# EAGLE design msp_talking_tom_v5 (EAGLE 7.3.0)
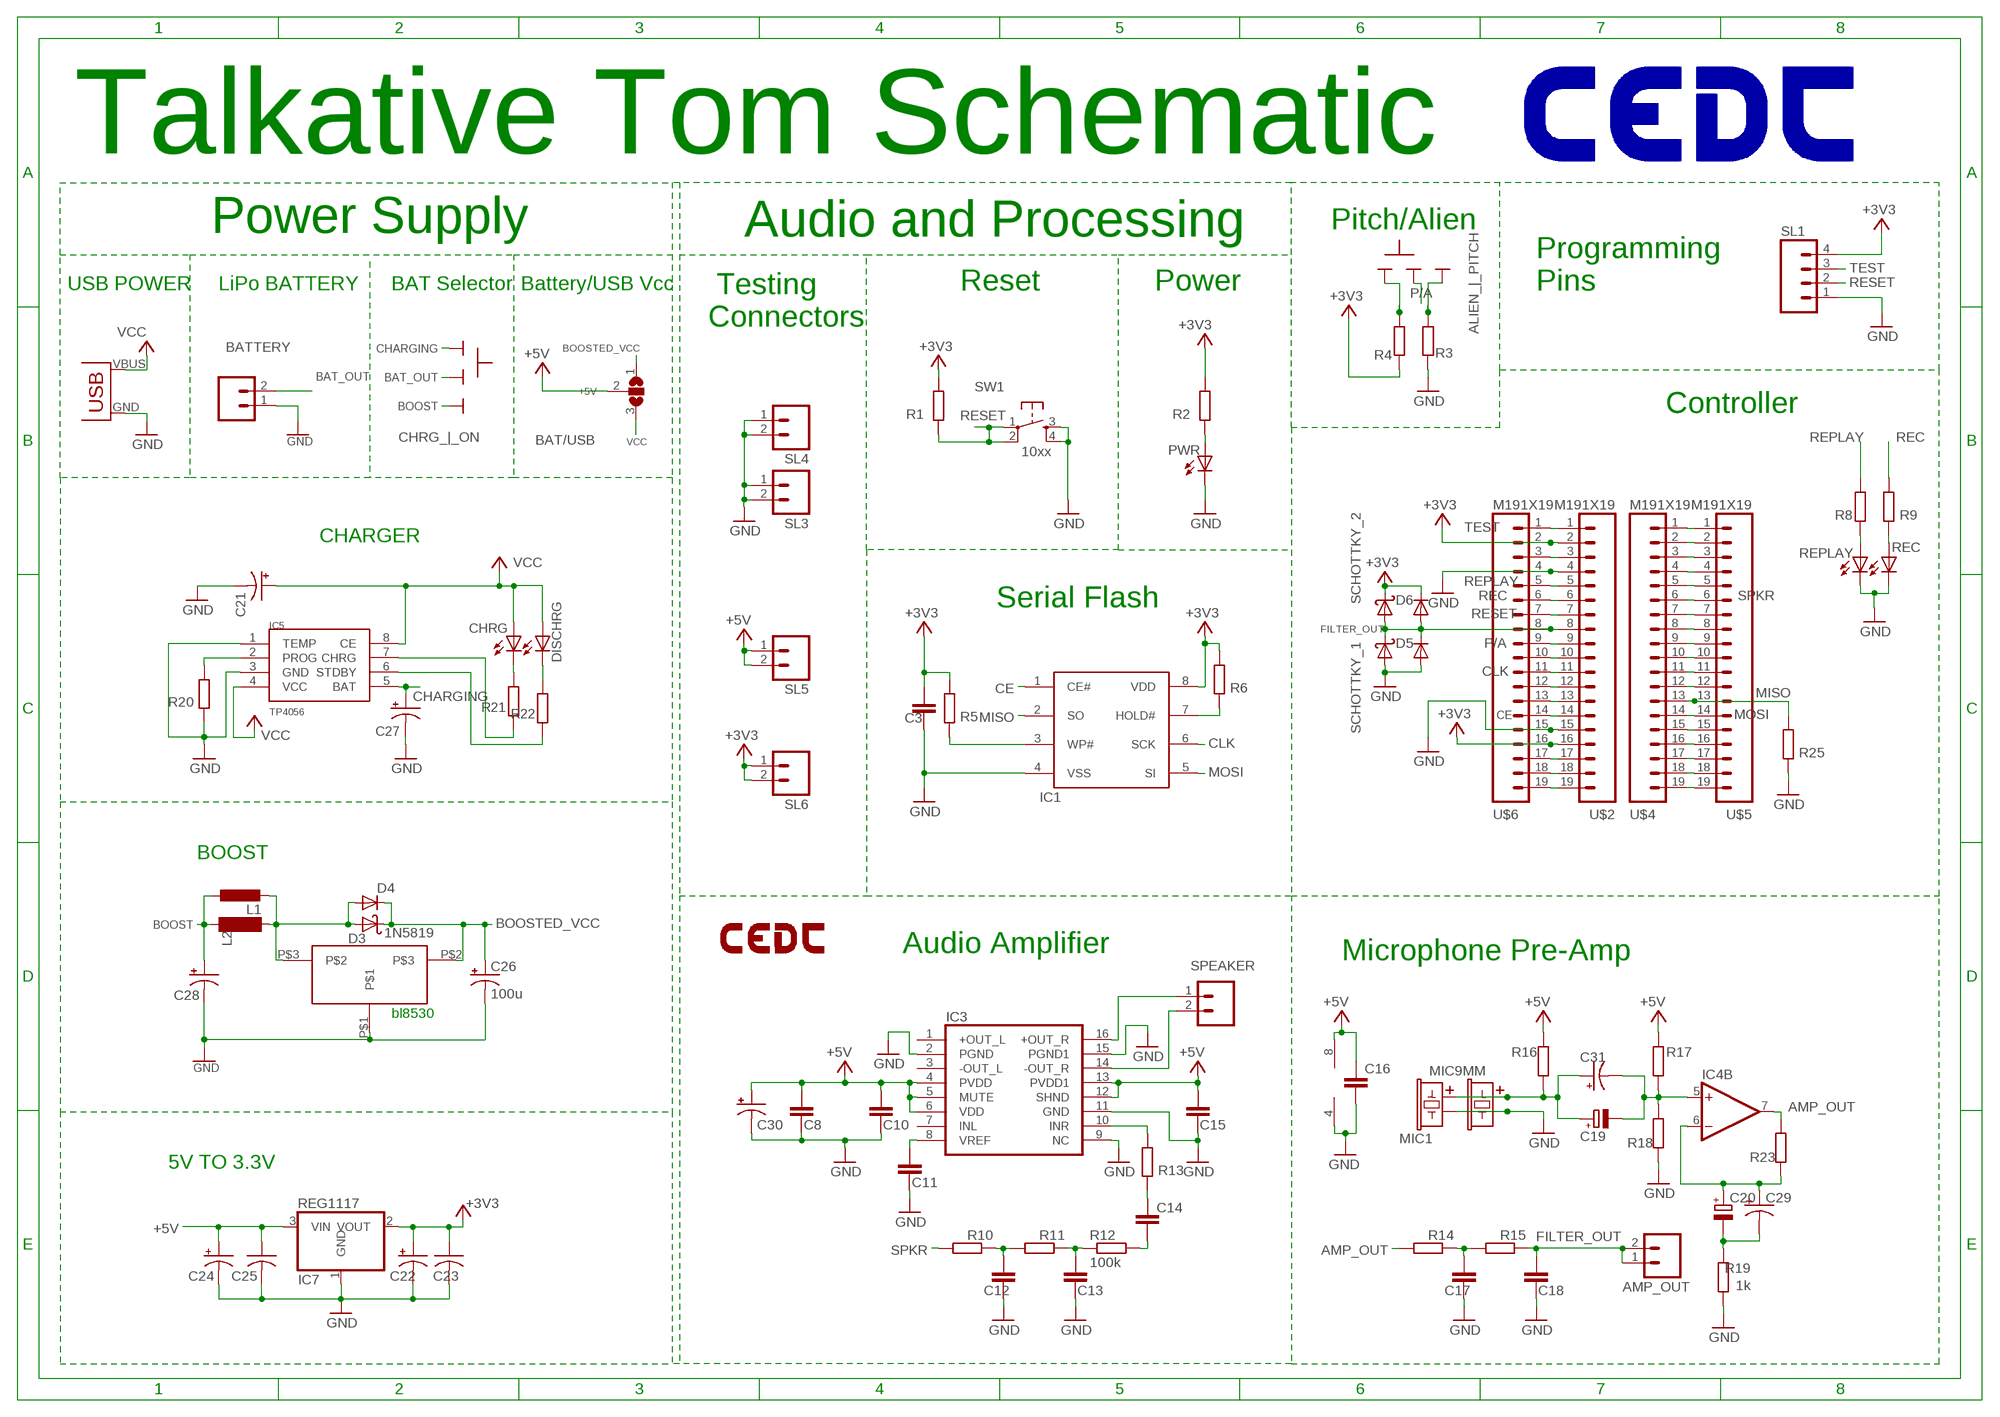
[diagram p0: schematic, sheet 1]

## Parts
ALIEN_|_PITCH  SLIDESWITCH-BIG  [BIGSWITCH]
AMP_OUT  M02  [02P]
BAT/USB  SJ2W  [SJ_2]
BATTERY  M02JST-PTH-2  M02  [02P]
C3  0.1u  C-EUC0805  [C0805]
C8  1uf  C-EUC1206  [C1206]
C10  1uf  C-EUC1206  [C1206]
C11  0.1uf  C-EUC1206  [C1206]
C12  0.1u  C-EUC0805  [C0805]
C13  0.1uf  C-EUC0805  [C0805]
C14  0.47uF  C-EUC0603  [C0603]
C15  1uf  C-EUC1206  [C1206]
C16  0.1u  C-EUC0805  [C0805]
C17  0.1u  C-EUC0805  [C0805]
C18  0.1u  C-EUC0805  [C0805]
C19  10u  CPOL-EUE2.5-5  [E2,5-5]
C20  10u  CPOL-EUE2.5-5  [E2,5-5]
C21  10u  CAP_POL_10V  [C/6032-28R]
C22  10u  CAP_POL_10V  [C/6032-28R]
C23  0.1u  CAP0805  [C0805]
C24  10u  CAP_POL_10V  [C/6032-28R]
C25  0.1u  CAP0805  [C0805]
C26  100u  CAP_POL_10V  [C/6032-28R]
C27  10u  CAP_POL_10V  [C/6032-28R]
C28  10u  CAP_POL_10V  [C/6032-28R]
C29  10u  CAP_POL_10V  [C/6032-28R]
C30  CAP_POL_10V  [C/6032-28R]
C31  10u  CAP_POL_10V  [C/6032-28R]
CHRG  LED3MM  [LED3MM]
CHRG_|_ON  SLIDESWITCH-BIG  [BIGSWITCH]
D3  1N5819  [DO41-10]
D4  DIODE_DIODE-DO214AC  [DIODE_DO214AC]
D5  DIODE_DIODE-DO214AC  [DIODE_DO214AC]
D6  DIODE_DIODE-DO214AC  [DIODE_DO214AC]
DISCHRG  LED3MM  [LED3MM]
IC1  SST25VF040B_SPI_FLASH  [SOIC08]
IC3  PAM8403  [SOP-16]
IC4  LM358N  [DIL08]
IC5  TP4056  [SOP-8]
IC6  BL8530_5V  [BL8530_5V]
IC7  REG1117  [SOT223]
L1  L-EUL5650M  [L5650M]
L2  47uH  MS85  [MS85]
LOGO2  LOGO-CEDTSILK-18MM  [LOGO-CEDT-SILK-18MM]
MIC1  MICMIC-4.5MM  [MIC-4.5MM]
MIC9MM  MIC9.7MM  [MIC-9.7MM]
PWR  LED3MM  [LED3MM]
R1  10k  R-EU_0204/7  [0204/7]
R2  1k  R-EU_0204/7  [0204/7]
R3  10k  R-EU_0204/7  [0204/7]
R4  10k  R-EU_0204/7  [0204/7]
R5  10k  R-EU_0204/7  [0204/7]
R6  10k  R-EU_0204/7  [0204/7]
R8  1k  R-EU_0204/7  [0204/7]
R9  1k  R-EU_0204/7  [0204/7]
R10  330  R-EU_0204/7  [0204/7]
R11  330  R-EU_0204/7  [0204/7]
R12  100k  R-EU_0204/7  [0204/7]
R13  10k  R-EU_0204/7  [0204/7]
R14  330  R-EU_0204/7  [0204/7]
R15  330  R-EU_0204/7  [0204/7]
R16  4.7k  R-EU_0204/7  [0204/7]
R17  20k  R-EU_0204/7  [0204/7]
R18  10k  R-EU_0204/7  [0204/7]
R19  1k  R-EU_0204/7  [0204/7]
R20  R-EU_0204/7  [0204/7]
R21  470  R-EU_0204/7  [0204/7]
R22  470  R-EU_0204/7  [0204/7]
R23  20k  R-EU_0204/7  [0204/7]
R25  10k  R-EU_0204/7  [0204/7]
REC  LED3MM  [LED3MM]
REPLAY  LED3MM  [LED3MM]
SCHOTTKY_1  1N5819  [DO41-10]
SCHOTTKY_2  1N5819  [DO41-10]
SL1  M04  [04P]
SL3  M02  [02P]
SL4  M02  [02P]
SL5  M02  [02P]
SL6  M02  [02P]
SPEAKER  M02JST-PTH-VERT  M02  [02P]
SW1  10xx  OMRON_SWITCH_10-XX  [B3F-10XX]
U$1  USB(POWER)  [USB(POWER)]
U$2  M191X19  [1X19]
U$4  M191X19  [1X19]
U$5  M191X19  [1X19]
U$6  M191X19  [1X19]

## Nets
+3V3: C3.1 C22.+ C23.1 D6.C IC1.8(VDD) IC7.2(VOUT) R1.2 R2.2 R4.2 R5.1 R6.2 SCHOTTKY_2.C SL1.4 SL6.1 SL6.2 U$2.2 U$2.16 U$6.2 U$6.16
+5V: BAT/USB.2 C8.1 C10.2 C15.2 C16.1 C24.+ C25.1 C30.+ IC3.4(PVDD) IC3.5(MUTE) IC3.6(VDD) IC3.12(SHND) IC3.13(PVDD1) IC4.8(P:V+) IC7.3(VIN) R16.2 R17.2 SL5.1 SL5.2
AMP_OUT: IC4.7(B:OUT) R14.1 R23.2
AVCC: U$4.16 U$5.16
BAT_OUT: BATTERY.2 CHRG_|_ON.2
BOOST: C28.+ CHRG_|_ON.3 L1.1 L2.1
BOOSTED_VCC: BAT/USB.1 C26.+ D3.C D4.C IC6.P$2
CE: IC1.1(CE#) U$2.14 U$6.14
CHARGING: C27.+ CHRG_|_ON.1 IC5.5(BAT)
CLK: IC1.6(SCK) U$2.11 U$6.11
DVCC: U$4.2 U$5.2
FILTER_OUT: AMP_OUT.1 AMP_OUT.2 C18.1 D5.C D6.A R15.2 SCHOTTKY_1.C SCHOTTKY_2.A U$2.8 U$6.8
GND: BATTERY.1 C3.2 C8.2 C10.1 C11.2 C12.2 C13.2 C15.1 C16.2 C17.2 C18.2 C21.- C22.- C23.2 C24.- C25.2 C26.- C27.- C28.- C30.- D5.A IC1.4(VSS) IC3.2(PGND) IC3.9(NC) IC3.11(GND) IC3.15(PGND1) IC4.4(P:V-) IC5.1(TEMP) IC5.3(GND) IC6.P$1 IC7.1(GND) MIC1.+ MIC9MM.2 PWR.K(C) R3.2 R18.1 R19.1 R20.1 R25.1 REC.K(C) REPLAY.K(C) SCHOTTKY_1.A SL1.1 SL3.1 SL3.2 SL4.1 SL4.2 SW1.3(S) SW1.4(S1) U$1.GND U$2.4 U$2.15 U$6.4 U$6.15
MICIN1: C13.1 R11.2 R12.1
MISO: IC1.2(SO) R25.2 U$4.13 U$5.13
MOSI: IC1.5(SI) U$4.14 U$5.14
N$1: U$2.3 U$6.3
N$2: IC1.7(HOLD#) R6.1
N$3: IC1.3(WP#) R5.2
N$4: U$4.1 U$5.1
N$5: U$4.15 U$5.15
N$6: ALIEN_|_PITCH.3 R3.1
N$7: U$4.4 U$5.4
N$8: IC3.16(+OUT_R) SPEAKER.1
N$9: IC3.14(-OUT_R) SPEAKER.2
N$10: C14.2 R13.2
N$11: IC3.10(INR) R13.1
N$12: C12.1 R10.2 R11.1
N$13: PWR.A R2.1
N$14: C17.1 R14.2 R15.1
N$18: IC5.2(PROG) R20.2
N$19: IC5.7(CHRG) R21.1
N$20: C14.1 R12.2
N$21: R8.1 REPLAY.A
N$22: C11.1 IC3.8(VREF)
N$24: ALIEN_|_PITCH.1 R4.1
N$25: IC5.6(STDBY) R22.1
N$27: CHRG.K(C) R21.2
N$28: DISCHRG.K(C) R22.2
N$29: D3.A D4.A IC6.P$3 L1.2 L2.2
N$30: C19.+ C31.+ MIC1.- MIC9MM.1 R16.1
N$32: C19.- C31.- IC4.5(B:+IN) R17.1 R18.2
N$33: C20.+ C29.+ IC4.6(B:-IN) R23.1
N$34: R9.2 REC.A
N$35: U$2.19 U$6.19
N$36: C20.- C29.- R19.2
N$37: U$2.18 U$6.18
N$38: U$2.17 U$6.17
N$39: U$2.13 U$6.13
N$40: U$2.12 U$6.12
N$41: U$2.10 U$6.10
N$47: U$4.3 U$5.3
N$48: U$4.5 U$5.5
N$49: U$4.7 U$5.7
N$50: U$4.8 U$5.8
N$51: U$4.9 U$5.9
N$52: U$4.10 U$5.10
N$55: U$4.11 U$5.11
N$56: U$4.12 U$5.12
N$57: U$4.17 U$5.17
N$58: U$4.18 U$5.18
N$59: U$4.19 U$5.19
P/A: ALIEN_|_PITCH.2 U$2.9 U$6.9
REC: R9.1 U$2.6 U$6.6
REPLAY: R8.2 U$2.5 U$6.5
RESET: R1.1 SL1.2 SW1.1(P) SW1.2(P1) U$2.7 U$6.7
SPKR: R10.1 U$4.6 U$5.6
TEST: SL1.3 U$2.1 U$6.1
VCC: BAT/USB.3 C21.+ CHRG.A DISCHRG.A IC5.4(VCC) IC5.8(CE) U$1.VBUS(VCC)
Unconnected: IC3.1(+OUT_L) IC3.3(-OUT_L) IC3.7(INL) IC4.1(A:OUT) IC4.2(A:-IN) IC4.3(A:+IN)

## Notes on the sheet
- Talkative Tom Schematic
- Power Supply | Audio and Processing | Pitch/Alien
- USB POWER | LiPo BATTERY | BAT Selector | Battery/USB Vcc | Reset | Power
- Programming
  Pins
- Testing 
  Connectors
- Controller
- CHARGER
- Serial Flash
- BOOST
- Audio Amplifier | Microphone Pre-Amp
- bl8530
- 5V TO 3.3V

## Library data of the parts
ALIEN_|_PITCH CHRG_|_ON = CEDT_JANUARY_2015_v5:SLIDESWITCH
AMP_OUT BATTERY SPEAKER = CEDT_JANUARY_2015_v5:M02: AMP QUICK CONNECTOR
BAT/USB = jumper:SJ2W: SMD solder JUMPER
C3 C8 C10 C11 C14 C15 = rcl:C-EU: CAPACITOR, European symbol
C12 C13 C17 C18 = Arduino_Hackathon_v5:C-EU: CAPACITOR, European symbol
C16 = resistor:C-EU: CAPACITOR, European symbol
C19 C20 = rcl:CPOL-EU: POLARIZED CAPACITOR, European symbol
C21 C26 C29 C31 = CEDT_JANUARY_2015_v7:CAP_POL
C22 C24 C27 C28 = CEDT_JANUARY_2015_v5:CAP_POL
C23 C25 = CEDT_JANUARY_2015_v5:CAP
C30 = CEDT_SEPTEMBER_V2:CAP_POL
CHRG DISCHRG = adafruit:LED: LED OSRAM: - CHIPLED LG R971, LG N971, LY N971, LG Q971, LY Q971, LO R971, LY R971 LH N974, LH R974 LS Q976, LO Q976, LY Q976 LO Q996 - Hyper CHIPLED LW Q18S LB Q993, LB Q99A, LB R99A - SideLED LS A670, LO A670, LY A670, LG A670, LP A670 LB A673, LV A673, LT A673, LW A673 LH A674 LY A675 LS A676, LA A676, LO A676, LY A676, LW A676 LS A679, LY A679, LG A679 - Hyper Micro SIDELED® LS Y876, LA Y876, LO Y876, LY Y876 LT Y87S - SmartLED LW L88C, LW L88S LB L89C, LB L89S, LG L890 LS L89K, LO L89K, LY L89K LS L896, LA L896, LO L896, LY L896 - TOPLED LS T670, LO T670, LY T670, LG T670, LP T670 LSG T670, LSP T670, LSY T670, LOP T670, LYG T670 LG T671, LOG T671, LSG T671 LB T673, LV T673, LT T673, LW T673 LH T674 LS T676, LA T676, LO T676, LY T676, LB T676, LH T676, LSB T676, LW T676 LB T67C, LV T67C, LT T67C, LS T67K, LO T67K, LY T67K, LW E67C LS E67B, LA E67B, LO E67B, LY E67B, LB E67C, LV E67C, LT E67C LW T67C LS T679, LY T679, LG T679 LS T770, LO T770, LY T770, LG T770, LP T770 LB T773, LV T773, LT T773, LW T773 LH T774 LS E675, LA E675, LY E675, LS T675 LS T776, LA T776, LO T776, LY T776, LB T776 LHGB T686 LT T68C, LB T68C - Hyper Mini TOPLED® LB M676 - Mini TOPLED Santana® LG M470 LS M47K, LO M47K, LY M47K Source: http://www.osram.convergy.de/
D3 = arduinodaya_v9:1N5819: DIODE general purpose rectifier, 1 A
D4-D6 = TalkingTom_FINAL3_print:DIODE_DIODE-: DIODE
IC1 = CEDT_JANUARY_2015_v5:SST25VF040B_SPI_FLASH
IC3 = PAM8403:PAM8403: Dual channel audio amplifier IC - PAM8403
IC4 = CEDT_JANUARY_2015_v6 (2):LM358: OP AMP also LM158; LM258; LM2904 Source: http://cache.national.com/ds/LM/LM158.pdf
IC5 = TP4056:TP4056
IC6 = PSU_TT_SMD:BL8530_5V
IC7 = CEDT_JANUARY_2015_v5:REG1117: 800mA and 1A Low Dropout (LDO) Positive Regulator 1.8V, 2.5V, 2.85V, 3.3V, 5V, and Adj
L1 = TalkingTom_FINAL:L-EU: INDUCTOR, European symbol
L2 = inductor-neosid:MS85: INDUCTOR SMD power inductor; OC_FARNELL: unknown; OC_NEWARK: unknown
LOGO2 = CEDT_JANUARY_2015_v5:LOGO-CEDT
MIC1 MIC9MM = arduinodaya_v9:MIC: Microphone Omni-directional electret microphone. 9.7mm standard diameter.
PWR REC REPLAY = 01_adafruit:LED: LED OSRAM: - CHIPLED LG R971, LG N971, LY N971, LG Q971, LY Q971, LO R971, LY R971 LH N974, LH R974 LS Q976, LO Q976, LY Q976 LO Q996 - Hyper CHIPLED LW Q18S LB Q993, LB Q99A, LB R99A - SideLED LS A670, LO A670, LY A670, LG A670, LP A670 LB A673, LV A673, LT A673, LW A673 LH A674 LY A675 LS A676, LA A676, LO A676, LY A676, LW A676 LS A679, LY A679, LG A679 - Hyper Micro SIDELED® LS Y876, LA Y876, LO Y876, LY Y876 LT Y87S - SmartLED LW L88C, LW L88S LB L89C, LB L89S, LG L890 LS L89K, LO L89K, LY L89K LS L896, LA L896, LO L896, LY L896 - TOPLED LS T670, LO T670, LY T670, LG T670, LP T670 LSG T670, LSP T670, LSY T670, LOP T670, LYG T670 LG T671, LOG T671, LSG T671 LB T673, LV T673, LT T673, LW T673 LH T674 LS T676, LA T676, LO T676, LY T676, LB T676, LH T676, LSB T676, LW T676 LB T67C, LV T67C, LT T67C, LS T67K, LO T67K, LY T67K, LW E67C LS E67B, LA E67B, LO E67B, LY E67B, LB E67C, LV E67C, LT E67C LW T67C LS T679, LY T679, LG T679 LS T770, LO T770, LY T770, LG T770, LP T770 LB T773, LV T773, LT T773, LW T773 LH T774 LS E675, LA E675, LY E675, LS T675 LS T776, LA T776, LO T776, LY T776, LB T776 LHGB T686 LT T68C, LB T68C - Hyper Mini TOPLED® LB M676 - Mini TOPLED Santana® LG M470 LS M47K, LO M47K, LY M47K Source: http://www.osram.convergy.de/
R1-R6 R8-R11 R14 R15 R18 R20-R23 R25 = rcl:R-EU_: RESISTOR, European symbol
R12 R13 R16 R17 R19 = resistor:R-EU_: RESISTOR, European symbol
SCHOTTKY_1 SCHOTTKY_2 = CEDT_JANUARY_2015_v6 (2):1N5819: DIODE general purpose rectifier, 1 A
SL1 = con-amp-quick:M04: AMP QUICK CONNECTOR; OC_FARNELL: unknown; OC_NEWARK: unknown
SL3-SL6 = CEDT_JANUARY_2015_v7:M02: AMP QUICK CONNECTOR
SW1 = CEDT_JANUARY_2015_v5:OMRON_SWITCH
U$1 = CEDT_JANUARY_2015_v7:USB(POWER)
U$2 U$4-U$6 = SparkFun-Connectors:M19: 1x19 .1" header

## Net classes
0 default: width 0.508 mm

## Board
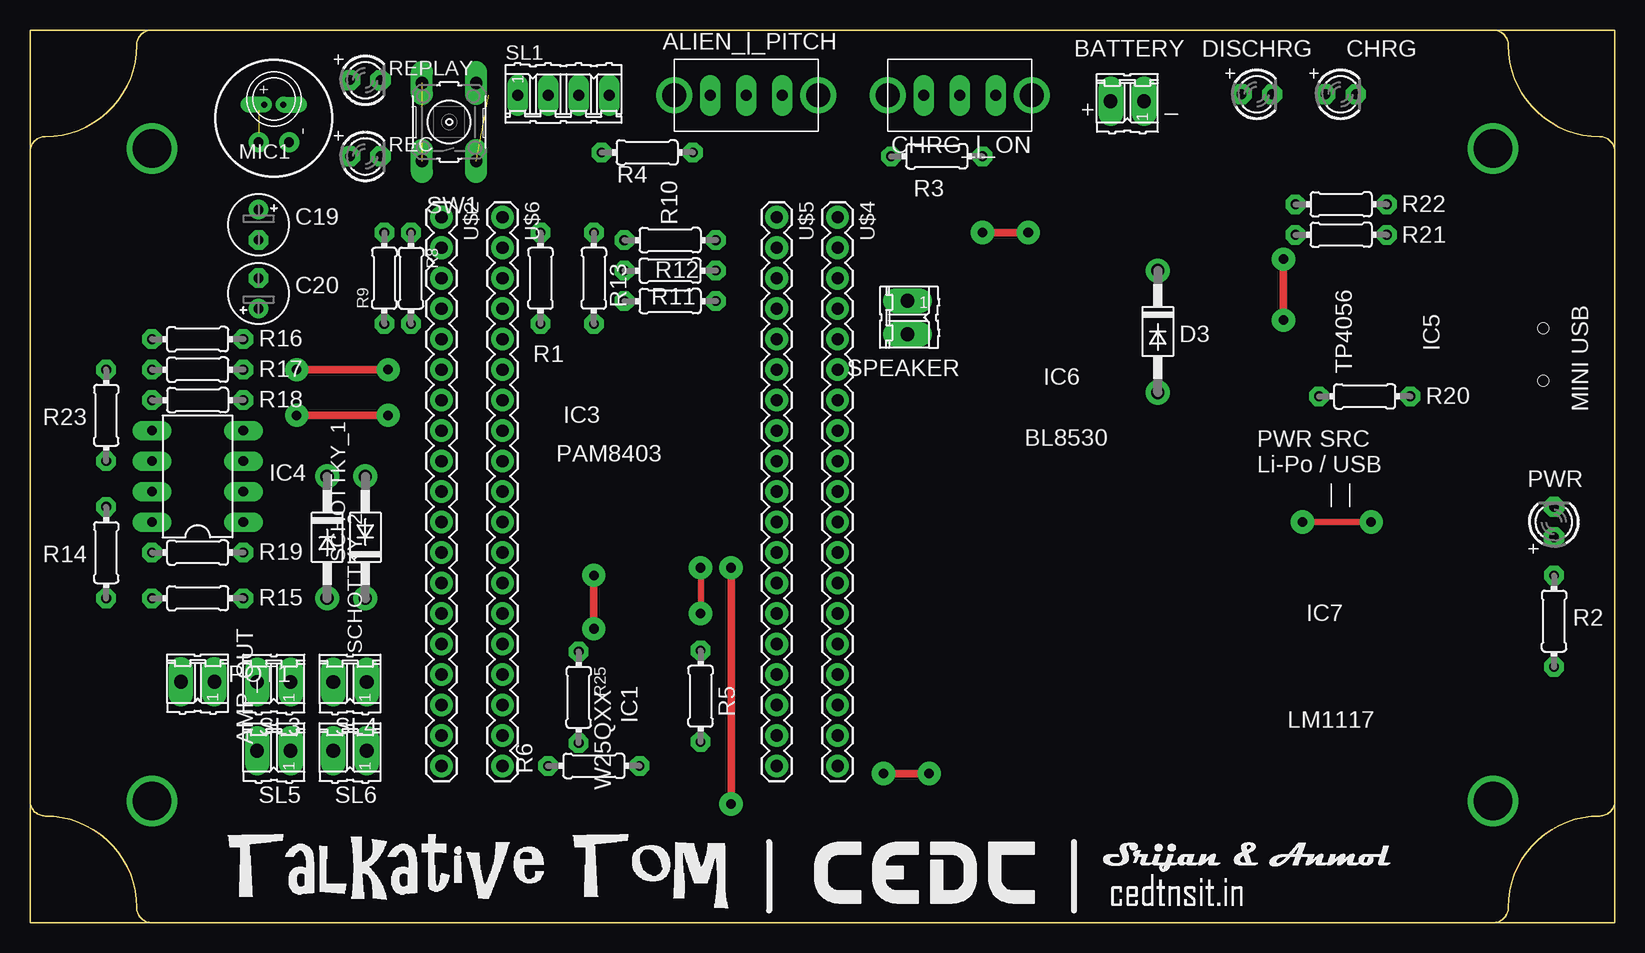
[diagram p1: board, top side]
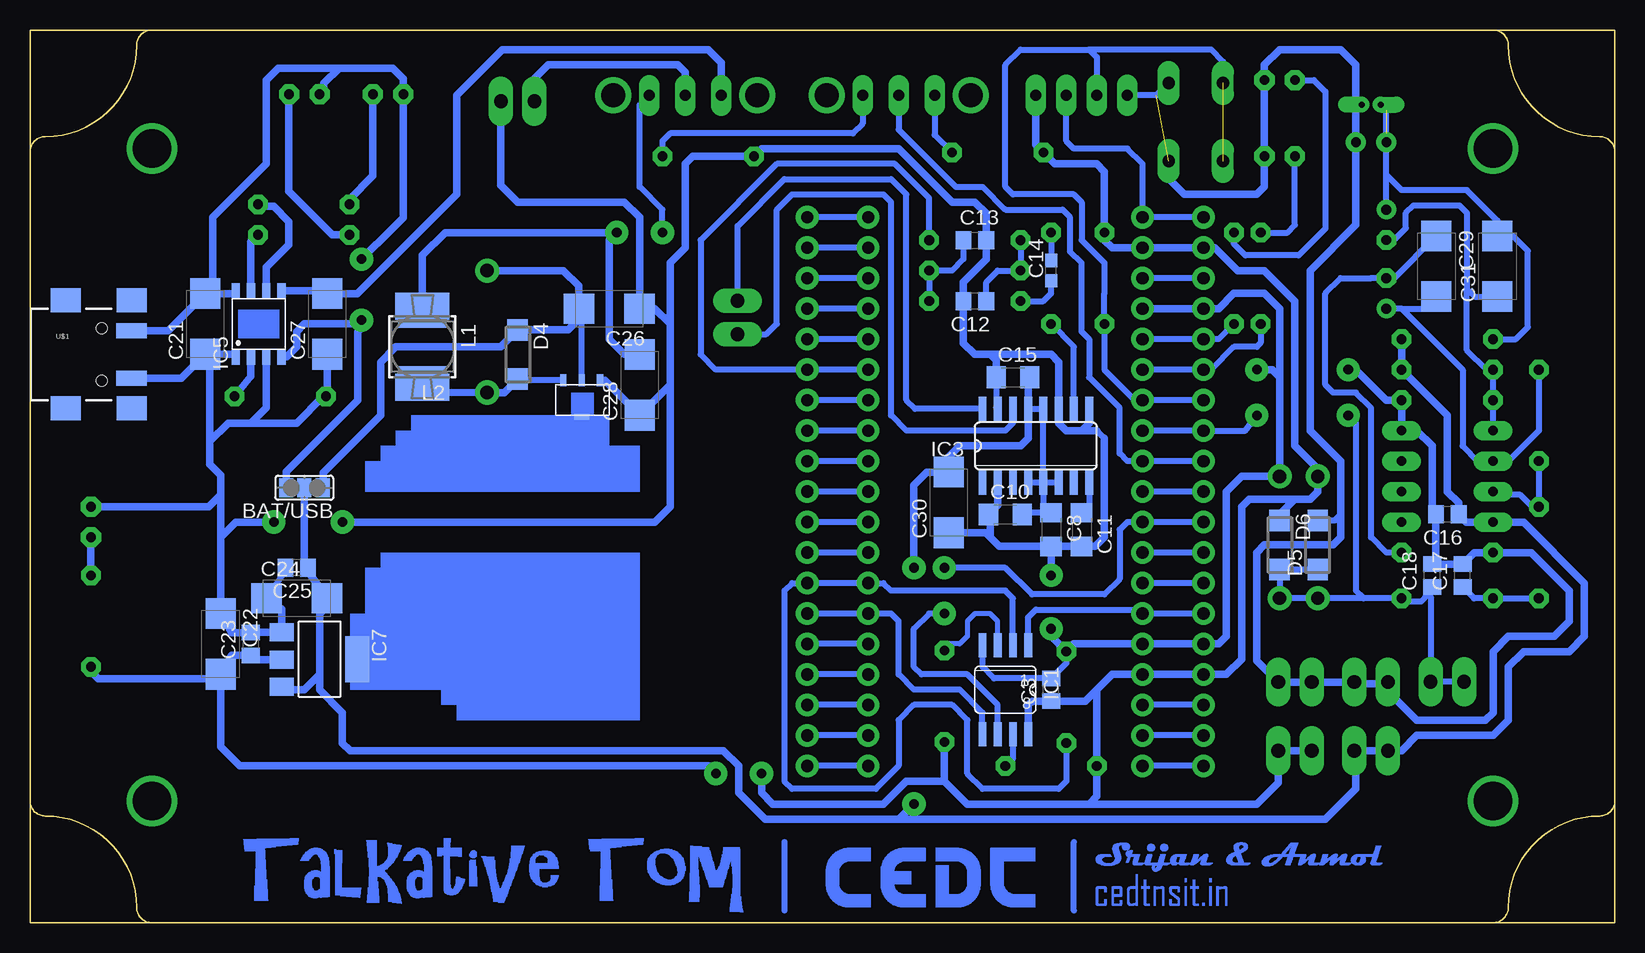
[diagram p2: board, bottom side, seen from below]

Size 132.08 x 74.39 mm. Coordinates in mm from the lower left corner, seen from the top.
Outline: 10.16,0 121.92,0 arc90 123.19,1.27
Outline: 123.19,1.27 arc-90 130.81,8.89 arc90 132.08,10.16 132.08,64.23 arc90 130.81,65.5 arc-90 123.19,73.12 arc90 121.92,74.39 10.16,74.39 arc90 8.89,73.12 arc-90 1.27,65.5 arc90 0,64.23 0,10.16 arc90 1.27,8.89 arc-90 8.89,1.27
Outline: 10.16,0 arc-90 8.89,1.27
Outline: 10.16,0 arc-90 8.89,1.27
Copper layers (1*16): Top 0.035mm / dielectric 1.5mm / Bottom 0.035mm
Design rules "default *": minimum track width 20mil, minimum drill 24mil, track to track 16mil, track to pad 16mil, pad to pad 16mil, via to via 16mil, smd to smd 8mil, copper to edge 40mil, drill to drill 8mil, minimum pad ring 16mil, minimum via ring 16mil, stop-mask expansion 4mil, vias tented up to drill 0mil, thermal gap 10mil
Milling: area 0,64.2 to 10.2,74.4; area 121.9,64.2 to 132.1,74.4; area 121.9,0 to 132.1,10.2; area 0,0 to 10.2,10.2

### Footprints (pad centres in the part's own frame; a part is rotated, then mirrored left to right if it is on the bottom)
BIGSWITCH = drill 0.9 long: 1 -3,0; 2 0,0; 3 3,0 | drill 2 pad 2.184: TAB1 -6,0; TAB2 6,0
02P = drill 1.143 long: 1 -1.397,0; 2 1.397,0
SJ_2 = smd 1.168 x 1.6: 1 -1.524,0; 2 0,0; 3 1.524,0
C0805 = smd 1.3 x 1.5: 1 -0.95,0; 2 0.95,0
C1206 = smd 1.6 x 1.8: 1 -1.4,0; 2 1.4,0
C0603 = smd 1.1 x 1: 1 -0.85,0; 2 0.85,0
E2,5-5 = drill 0.813 pad 1.6: + -1.27,0 | drill 0.813 pad 1.6 octagon: - 1.27,0
C/6032-28R = smd 2.55 x 2.5: + 2.525,0; - -2.525,0
LED3MM = drill 0.813 pad 1.676 octagon: A -1.27,0; K 1.27,0
DO41-10 = drill 1.118: A 5.08,0; C -5.08,0
DIODE_DO214AC = smd 1.8 x 1.7: A 2.05,0; C -2.05,0
SOIC08 = smd 0.66 x 2.032: 1 -1.905,-3.708; 2 -0.635,-3.708; 3 0.635,-3.708; 4 1.905,-3.708; 5 1.905,3.708; 6 0.635,3.708; 7 -0.635,3.708; 8 -1.905,3.708
SOP-16 = smd 0.66 x 2.032: 1 -4.445,-3.073; 2 -3.175,-3.073; 3 -1.905,-3.073; 4 -0.635,-3.073; 5 0.635,-3.073; 6 1.905,-3.073; 7 3.175,-3.073; 8 4.445,-3.073; 9 4.445,3.073; 10 3.175,3.073; 11 1.905,3.073; 12 0.635,3.073; 13 -0.635,3.073; 14 -1.905,3.073; 15 -3.175,3.073; 16 -4.445,3.073
DIL08 = drill 0.813 long: 1 -3.81,-3.81; 2 -1.27,-3.81; 3 1.27,-3.81; 4 3.81,-3.81; 5 3.81,3.81; 6 1.27,3.81; 7 -1.27,3.81; 8 -3.81,3.81
SOP-8 = smd 1.3 x 0.7: 1 -2.75,1.905; 2 -2.75,0.635; 3 -2.75,-0.635; 4 -2.75,-1.905; 5 2.75,-1.905; 6 2.75,-0.635; 7 2.75,0.635; 8 2.75,1.905
BL8530_5V = smd 0.508 x 1.016: P$1 0.762,-0.381; P$2 2.286,-0.381; P$3 3.81,-0.381 | smd 1.27 x 0.508: P$4 2.286,2.667
SOT223 = smd 1.499 x 2.007: 1 -2.261,-3.15; 2 0.025,-3.15; 3 2.311,-3.15 | smd 3.81 x 2.007: 4 0,3.15
L5650M = smd 1.8 x 4: 1 -2.5,0; 2 2.5,0
MS85 = smd 4.5 x 2.25: 1 0,-3.383; 2 0,3.383
MIC-4.5MM = drill 0.5 offset: + 0.8,0.5; - -0.8,0.5
MIC-9.7MM = drill 0.8 pad 1.676: 1 -2,1.27; 2 -2,-1.27
0204/7 = drill 0.813 octagon: 1 -3.81,0; 2 3.81,0
04P = drill 0.914 long: 1 -3.81,0; 2 -1.27,0; 3 1.27,0; 4 3.81,0
B3F-10XX = drill 1.016 long: 1 -3.251,2.261; 2 3.251,2.261; 3 -3.251,-2.261; 4 3.251,-2.261
USB(POWER) = smd 2.54 x 1.27: GND 2.5,-1.981; VBUS 2.5,1.981 | smd 2.5 x 2: GND@1 -3,-4.5; GND@2 -3,4.5; GND@3 2.5,4.5; GND@4 2.5,-4.5 | hole 0.9: 0,2.2; 0,-2.2
1X19 = drill 1.016 pad 1.88: 1 0,0; 2 2.54,0; 3 5.08,0; 4 7.62,0; 5 10.16,0; 6 12.7,0; 7 15.24,0; 8 17.78,0; 9 20.32,0; 10 22.86,0; 11 25.4,0; 12 27.94,0; 13 30.48,0; 14 33.02,0; 15 35.56,0; 16 38.1,0; 17 40.64,0; 18 43.18,0; 19 45.72,0

### Placement (x,y rotation side)
ALIEN_|_PITCH  59.69,68.94 0 top
AMP_OUT  13.97,20.08 180 top
BAT/USB  109.22,36.24 180 bottom
BATTERY  91.44,68.44 180 top
C3  46.99,19.41 90 bottom
C8  46.99,32.75 270 bottom
C10  50.8,34.02 0 bottom
C11  44.45,32.75 270 bottom
C12  53.34,51.8 180 bottom
C13  53.34,56.88 0 bottom
C14  46.99,54.34 90 bottom
C15  50.16,45.45 0 bottom
C16  13.97,34.02 180 bottom
C17  12.7,28.94 90 bottom
C18  15.24,28.94 90 bottom
C19  19.05,58.15 270 top
C20  19.05,52.43 90 top
C21  117.48,49.89 90 bottom
C22  116.2,23.23 270 bottom
C23  113.67,23.23 90 bottom
C24  109.86,27.04 0 bottom
C25  109.86,29.57 180 bottom
C26  83.82,51.16 180 bottom
C27  107.31,49.89 90 bottom
C28  81.28,44.81 90 bottom
C29  14.88,54.7 270 bottom
C30  55.52,35.02 90 bottom
C31  9.8,54.7 90 bottom
CHRG  109.22,69.04 0 top
CHRG_|_ON  77.47,68.94 0 top
D3  93.98,49.26 270 top
D4  91.44,47.35 270 bottom
D5  24.76,31.48 90 bottom
D6  27.94,31.48 270 bottom
DISCHRG  102.23,69.04 0 top
IC1  50.8,19.41 180 bottom
IC3  48.26,39.73 0 bottom
IC4  13.97,37.2 90 top
IC5  113.03,49.89 90 bottom
IC6  83.82,44.81 180 bottom
IC7  107.95,21.96 270 bottom
L1  99.38,47.99 270 bottom
L2  99.38,47.99 180 bottom
LOGO2  65.4,1.63 0 top
MIC1  20.32,67.67 0 top
MIC9MM  20.32,67.04 90 top
PWR  127,33.38 90 top
R1  42.55,53.7 90 top
R2  127,25.13 270 top
R3  75.56,63.86 180 top
R4  51.44,64.18 180 top
R5  55.88,18.87 90 top
R6  46.99,13.06 180 top
R8  31.75,53.7 270 top
R9  29.53,53.7 90 top
R10  53.34,56.88 180 top
R11  53.34,54.34 0 top
R12  53.34,51.8 180 top
R13  46.99,53.7 90 top
R14  6.35,30.84 270 top
R15  13.97,27.04 0 top
R16  13.97,48.62 0 top
R17  13.97,46.08 0 top
R18  13.97,43.54 180 top
R19  13.97,30.84 0 top
R20  111.22,43.86 0 top
R21  109.26,57.32 180 top
R22  109.26,59.86 180 top
R23  6.35,42.27 270 top
R25  45.72,18.78 270 top
REC  27.94,63.86 0 top
REPLAY  27.94,70.21 0 top
SCHOTTKY_1  27.94,32.11 90 top
SCHOTTKY_2  24.76,32.11 270 top
SL1  44.45,68.94 0 top
SL3  20.32,20.05 180 top
SL4  26.67,20.05 180 top
SL5  20.32,14.34 180 top
SL6  26.67,14.34 180 top
SPEAKER  73.12,50.43 270 top
SW1  34.93,66.72 90 top
U$1  126.11,47.35 0 bottom
U$2  34.29,58.78 270 top
U$4  67.31,58.78 270 top
U$5  62.23,58.78 270 top
U$6  39.37,58.78 270 top

### Tracks (layer width: path | path; a pad name or v marks a point on that pad's centre or on a via)
+3V3  (via drill 0.8 pad 1.93)
  Top 0.61: v71.12,12.43 v74.93,12.43
  Bottom 0.508: IC1.8 | R6.2 | 55.88,11.79 55.88,11.8 | 116.84,20.68 116.22,20.68 C22.+ | 42.54,58.15 R1.2 42.54,58.15 | SCHOTTKY_2.C 24.76,37.83 | D6.C 27.94,34.02
  Bottom 0.61: IC7.2 113.95,21.93 C23.1 115.26,22.28 C22.+ 116.58,20.32 126.38,20.32 127,20.94 R2.2 | IC1.8 48.89,18.14 48.57,18.46 C3.1 44.13,18.46 43.18,19.42 | R6.2 43.18,19.42 | 43.18,19.42 41.91,20.68 U$6.16 U$2.16 32.38,20.68 31.11,21.95 31.11,34.65 30.48,35.29 26.67,35.29 | R5.1 55.88,11.8 | 43.81,9.89 53.97,9.89 55.88,11.79 59.05,11.79 60.96,9.89 70.17,9.89 71.12,10.84 v71.12,12.43 | 43.81,9.89 43.18,10.52 R6.2 | 42.54,58.15 42.54,56.88 41.91,56.24 U$6.2 U$2.2 33.34,56.24 31.43,54.34 29.21,54.34 26.67,51.8 26.67,39.73 24.76,37.83 | 42.54,58.15 42.54,62.59 43.18,63.23 46.67,63.23 R4.2 48.26,64.82 SL1.4 | 43.81,9.89 29.84,9.89 28.07,11.67 SL6.1 SL6.2 | 26.67,35.29 25.4,35.29 24.76,35.92 SCHOTTKY_2.C | v74.93,12.43 75.56,13.06 114.62,13.06 116.2,14.65 C22.+ | 27.94,34.02 26.67,35.29
+5V  (via drill 0.8 pad 1.93)
  Top 0.61: v58.42,29.57 v58.42,9.89
  Bottom 0.508: 108.9,29.25 C25.1 | C10.2 49.27,34.15 C8.1 47.62,34.79 IC3.5 | IC3.6 IC3.5 | IC3.5 IC3.4 | 48.89,45.32 C15.2 | IC3.13 IC3.12 | IC3.5 | IC3.5 IC3.12 | IC3.12 | IC3.13 | SL5.2 | 7.62,33.39 7.62,33.38
  Bottom 0.61: R16.2 R17.2 13.97,42.28 13.97,35.93 13.02,34.98 C16.1 12.38,33.39 IC4.8 7.62,33.39 | 110.68,19.22 IC7.3 110.87,19.42 109.22,19.42 107.95,20.69 | 107.95,20.69 107.95,25.77 107.31,26.4 C24.+ 108.9,29.25 | 107.95,20.69 107.95,19.42 106.04,17.51 106.04,14.97 105.41,14.33 74.29,14.33 73.02,13.06 73.02,10.84 70.8,8.62 59.69,8.62 | BAT/USB.2 109.22,29.89 C25.1 | 48.89,45.32 IC3.13 48.89,40.37 49.53,39.73 54.61,39.73 55.51,38.83 C30.+ 57.34,37.55 58.42,36.46 v58.42,29.57 | SL5.2 SL5.1 21.59,14.21 21.59,11.16 24.13,8.62 59.69,8.62 | 7.62,33.38 2.54,28.3 2.54,23.86 3.81,22.59 7.62,22.59 8.89,21.32 8.89,16.87 10.16,15.6 16.51,15.6 17.78,14.33 SL5.2 | v58.42,9.89 59.69,8.62
AMP_OUT
  Bottom 0.508: R23.2 R14.1 6.89,34.66 7.89,35.66 9.89,35.66 IC4.7
AVCC
  Bottom 0.508: U$5.16 U$4.16
BAT_OUT
  Bottom 0.61: CHRG_|_ON.2 77.47,70.85 78.1,71.49 88.9,71.49 90.04,70.34 BATTERY.2
BOOST  (via drill 0.8 pad 1.93)
  Top 0.61: v79.37,57.52 v83.18,57.52
  Bottom 0.508: 81.29,47.36 C28.+ | 79.2,57.69 79.37,57.86 79.37,59.42 81.28,61.32 81.28,68.14 CHRG_|_ON.3
  Bottom 0.61: 81.29,47.36 82.55,47.36 83.82,48.63 83.82,56.88 v83.18,57.52 97.47,57.52 99.38,55.61 L2.1 L1.1 | v79.37,57.52 79.2,57.69
BOOSTED_VCC
  Bottom 0.508: IC6.P$2 86.11,50.53 86.11,50.93
  Bottom 0.61: 86.11,50.93 C26.+ 86.36,53.07 87.63,54.34 D3.C | BAT/USB.1 107.63,37.51 102.87,42.28 102.87,46.72 101.6,47.99 92.85,47.99 D4.C 87.23,49.4 86.11,50.53
CE
  Bottom 0.508: IC1.1 48.9,25.45 48.26,26.08 39.69,26.08 U$6.14 U$2.14
CHARGING
  Bottom 0.61: IC5.5 106.9,52.65 C27.+ 104.79,52.42 96.52,60.69 96.52,68.95 92.71,72.76 75.56,72.76 74.47,71.66 CHRG_|_ON.1
CLK  (via drill 0.8 pad 1.93)
  Top 0.508: v55.88,29.57 v55.88,25.76
  Bottom 0.508: IC1.6 51.44,18.15 53.97,20.68 57.78,20.68 58.42,21.32 58.42,24.49 57.15,25.76 v55.88,25.76 | v55.88,29.57 50.8,29.57 48.58,27.35 42.54,27.35 41.27,28.62 41.27,32.75 40.64,33.38 U$6.11 U$2.11
DVCC
  Bottom 0.508: U$5.2 U$4.2
FILTER_OUT  (via drill 0.8 pad 1.93)
  Top 0.61: v29.84,42.27 v22.22,42.27
  Bottom 0.508: AMP_OUT.2 AMP_OUT.1 15.37,19.96 15.37,27.16 15.56,27.35 | C18.1 15.24,27.67 15.56,27.35 | 15.56,27.35 16.14,26.77 17.51,26.77 R15.2 20.95,27.04 | 20.95,27.04 24.13,27.04 SCHOTTKY_2.A SCHOTTKY_1.C D6.A D5.C | 20.95,27.04 21.59,27.67 21.59,41.64 v22.22,42.27 | v29.84,42.27 30.8,41 U$2.8 U$6.8
GND  (via drill 0.8 pad 1.93)  (1 unrouted)
  Top 0.508: v111.76,33.39 v106.04,33.39
  Top 0.61: v29.84,46.08 v22.22,46.08 | v46.99,28.94 v46.99,24.49
  Bottom 0.508: IC6.P$1 84.19,45.2 | C28.- 81.26,42.29 | C24.- 110.8,29.25 C25.2 | IC5.1 115.16,47.37 | 78.74,34.65 78.74,34.66 | R25.1 45.72,21.63 C3.2 51.75,20.36 52.7,21.32 IC1.4 | 52.2,33.25 C10.1 52.07,34.15 | IC3.9 43.81,41.64 | C15.1 51.56,42.94 IC3.15 | C8.2 | IC4.4 | R19.1 | 46.99,29.57 v46.99,28.94 | 74.93,63.86 | 42.54,40.37 43.18,41 | D5.A 23.35,33.53 22.86,34.02 | SW1.4 38.21,68.94 SL1.1 | IC3.11 | 78.74,49.9 | 21.59,46.08
  Bottom 0.61: 84.19,45.2 C28.- 78.74,44.83 | 116.19,25.77 C22.- | C24.- 111.11,26.13 IC7.1 114.26,24.22 C23.2 115.26,24.18 C22.- | 81.28,51.18 C26.- | 81.28,51.18 80.02,51.18 78.74,49.9 | 78.74,49.9 78.74,44.83 | 116.2,35.66 116.2,32.12 | 116.2,32.12 C22.- | v106.04,33.39 80.01,33.39 78.74,34.66 78.74,44.83 | 115.16,47.37 C21.- | v111.76,33.39 114.93,33.39 116.2,32.12 | U$1.GND 119.47,45.37 C21.- | PWR.K 117.2,34.66 116.2,35.66 | 81.28,51.18 81.28,58.79 82.55,60.06 91.44,60.06 92.84,61.45 BATTERY.1 | R19.1 11.74,30.85 C17.2 C18.2 14.92,30.21 C16.2 15.24,34.34 15.24,39.74 16.51,41.01 IC4.4 R18.1 19.05,43.55 21.59,46.08 v22.22,46.08 | 116.2,35.66 116.2,37.29 117.11,38.2 117.11,40.1 | 117.11,40.1 117.11,47.01 C21.- | C27.- 107.31,43.96 R20.1 107.63,43.86 109.85,41.64 113.66,41.64 | 113.66,41.64 115.57,41.64 117.11,40.1 | IC5.3 112.39,42.91 113.66,41.64 | IC3.2 51.43,34.79 52.07,34.15 52.07,32.11 | 43.81,41.64 44.45,41 | 44.45,41 45.72,41 46.35,41.64 IC3.11 46.35,46.72 46.99,47.35 52.07,47.35 | 52.07,32.11 51.31,31.35 C8.2 | C30.- 52.45,32.5 52.07,32.11 | C8.2 C11.2 43.31,31.35 42.54,32.11 42.54,40.37 | 78.74,49.9 78.74,54.97 77.47,56.24 77.47,63.23 76.83,63.86 74.93,63.86 | 52.07,47.35 53.34,47.35 54.29,48.31 C12.2 54.29,53.39 52.39,55.29 C13.2 52.39,59.1 53.34,60.05 55.24,60.05 59.69,64.5 71.12,64.5 R3.2 74.93,63.86 | C15.1 51.56,46.85 52.07,47.35 | R19.1 6.98,30.84 3.81,27.67 3.81,25.13 5.08,23.86 8.89,23.86 10.16,22.59 10.16,17.51 10.79,16.87 16.51,16.87 19.05,19.41 19.05,19.92 | C8.2 46.99,29.57 | v46.99,24.49 46.99,23.86 R25.1 45.08,23.22 U$6.15 U$2.15 33.02,23.22 32.38,23.86 32.38,35.92 31.11,37.19 SCHOTTKY_1.A 27.94,45.45
  Bottom 0.61: 27.94,45.45 27.94,51.16 29.21,52.43 31.75,52.43 33.02,51.16 U$2.4 U$6.4 | 43.18,41 44.45,41 | 19.05,19.92 SL3.2 | 19.05,19.92 21.59,19.92 SL3.1 SL4.2 SL4.1 29.84,21.83 29.84,30.84 29.21,31.48 23.49,31.48 22.86,32.11 22.86,34.02 22.86,38.46 25.4,41 25.4,54.34 21.59,58.15 MIC9MM.2 21.59,67.67 21.12,68.14 MIC1.+ | v29.84,46.08 28.57,46.08 27.94,45.45 | MIC1.+ 21.59,68.64 21.59,71.48 22.86,72.75 27.94,72.75 29.21,71.48 REPLAY.K REC.K 29.21,61.32 29.84,60.69 35.88,60.69 37.15,61.96 37.26,63.23 SW1.3 | MIC1.+
MICIN1
  Bottom 0.508: 56.83,52.11 R12.1 R11.2 55.24,54.34 54.29,55.3 C13.1
MISO
  Bottom 0.508: R25.2 45.72,11.79 46.35,11.16 52.7,11.16 53.97,12.43 53.97,16.87 55.24,18.14 58.42,18.14 59.69,16.87 59.69,13.06 61.59,11.16 68.58,11.16 69.21,11.79 69.21,27.67 68.58,28.3 U$4.13 U$5.13 60.96,28.3 60.32,27.67 50.8,27.67 50.17,27.04 IC1.2
MOSI
  Bottom 0.508: IC1.5 52.71,17.51 54.61,19.41 58.42,19.41 59.69,20.68 59.69,25.13 60.32,25.76 U$5.14 U$4.14
N$1
  Bottom 0.508: U$2.3 U$6.3
N$2
  Bottom 0.508: IC1.7 50.17,13.7 R6.1
N$3
  Bottom 0.406: IC1.3 51.43,25.13 52.07,25.76 53.34,25.76 53.97,25.13 53.97,23.86 54.61,23.22 55.79,23.22 R5.2
N$4
  Bottom 0.508: U$5.1 U$4.1
N$5
  Bottom 0.508: U$5.15 U$4.15
N$6
  Bottom 0.508: ALIEN_|_PITCH.3 62.69,66.58 63.5,65.77 78.74,65.77 79.37,65.13 R3.1
N$7
  Bottom 0.508: U$5.4 U$4.4
N$8
  Bottom 0.508: IC3.16 58.32,42.81 59.05,43.54 59.05,60.69 60.32,61.96 69.21,61.96 73.12,58.05 SPEAKER.1
N$9
  Bottom 0.508: IC3.14 50.16,41.64 50.8,41 59.05,41 60.32,42.27 60.32,60.05 60.96,60.69 68.58,60.69 69.85,59.42 69.85,49.89 70.71,49.04 SPEAKER.2
N$10
  Bottom 0.508: R13.2 C14.2
N$11
  Bottom 0.508: IC3.10 45.08,47.99 R13.1
N$12
  Bottom 0.508: R10.2 R11.1 51.43,54.34 52.39,53.38 C12.1
N$13
  Bottom 0.61: R2.1 PWR.A
N$14
  Bottom 0.508: C17.1 11.74,27.04 R15.1 R14.2
N$15  (via drill 3.2 pad 3.81)
  other vias: 10.16,10.14
N$16  (via drill 3.2 pad 3.81)
  other vias: 121.92,64.5
N$17  (via drill 3.2 pad 3.81)
  other vias: 121.92,10.14
N$18
  Bottom 0.61: IC5.2 113.66,45.55 R20.2
N$19
  Bottom 0.61: IC5.7 113.66,56.73 R21.1
N$20
  Bottom 0.508: R12.2 47.62,51.8 46.99,52.43 C14.1
N$21
  Bottom 0.508: REPLAY.A 25.08,70.21 24.13,69.26 24.13,57.83 26.35,55.61 30.8,55.61 31.75,56.56 R8.1
N$22
  Bottom 0.508: IC3.8 43.81,34.79 C11.1
N$23  (via drill 3.2 pad 3.81)
  other vias: 10.16,64.5
N$24
  Bottom 0.508: R4.1 | ALIEN_|_PITCH.1 56.69,65.63 R4.1
N$25
  Bottom 0.61: IC5.6 112.39,54.63 110.51,56.52 110.51,58.42 111.78,59.69 112.89,59.69 R22.1
N$26
  Bottom 0.508: 45.08,1 45.08,6.71
N$27
  Bottom 0.61: R21.2 106.87,57.33 110.51,60.96 110.51,69.02 CHRG.K
N$28
  Bottom 0.61: R22.2 105.45,60.31 103.52,62.23 103.52,69.02 DISCHRG.K
N$29
  Bottom 0.508: IC6.P$3 91.01,45.2 D4.A
  Bottom 0.61: D4.A 92.56,44.18 D3.A 98.15,44.22 L2.2 L1.2
N$30  (1 unrouted)
  Bottom 0.508: C19.+ 19.05,62.33 | 19.05,62.33 19.05,67.71 MIC1.- | R16.1 8.25,48.63 7.25,49.63 7.25,55.98 8.52,57.25 9.14,57.25 C31.+ 9.79,58.52 12.33,61.06 17.78,61.06 19.05,62.33 | 19.05,64.5 MIC9MM.1 19.05,65.77
N$31
  Bottom 0.508: 69.21,6.71 69.21,1
N$32
  Bottom 0.508: R18.2 IC4.5 R17.1 10.7,46.09 12.33,47.72 12.33,52.8 | C19.- 18.41,56.88 17.41,57.88 17.41,59.15 16.78,59.79 12.97,59.79 12.33,59.15 12.33,52.8 | 12.33,52.8 11.7,52.17 10.44,52.17 C31.-
N$33
  Bottom 0.508: R23.1 6.35,41.01 8.89,38.47 IC4.6 11.43,38.47 12.7,39.74 12.7,46.09 17.78,51.17 | 17.78,51.17 C20.+ | 17.78,51.17 15.89,51.17 C29.+
N$34
  Bottom 0.508: R9.2 27.3,57.51 26.67,58.15 REC.A
N$35
  Bottom 0.508: U$2.19 U$6.19
N$36
  Bottom 0.508: R19.2 19.05,30.85 20.32,32.11 20.32,42.91 21.59,44.18 23.49,44.18 24.13,44.81 24.13,52.43 22.86,53.7 20.32,53.7 20.32,53.71 C20.- 18.4,53.71 C29.-
N$37
  Bottom 0.508: U$2.18 U$6.18
N$38
  Bottom 0.508: U$2.17 U$6.17
N$39
  Bottom 0.508: U$2.13 U$6.13
N$40
  Bottom 0.508: U$2.12 U$6.12
N$41
  Bottom 0.508: U$2.10 U$6.10
N$47
  Bottom 0.508: U$5.3 U$4.3
N$48
  Bottom 0.508: U$5.5 U$4.5
N$49
  Bottom 0.508: U$5.7 U$4.7
N$50
  Bottom 0.508: U$5.8 U$4.8
N$51
  Bottom 0.508: U$5.9 U$4.9
N$52
  Bottom 0.508: U$5.10 U$4.10
N$55
  Bottom 0.508: U$5.11 U$4.11
N$56
  Bottom 0.508: U$5.12 U$4.12
N$57
  Bottom 0.508: U$5.17 U$4.17
N$58
  Bottom 0.508: U$5.18 U$4.18
N$59
  Bottom 0.508: U$5.19 U$4.19
P/A
  Bottom 0.508: ALIEN_|_PITCH.2 59.69,66.09 54.93,61.32 52.7,61.32 50.8,59.42 46.04,59.42 45.4,58.78 45.4,55.93 44.45,54.97 44.45,49.26 43.81,48.62 43.81,45.45 41.27,42.91 41.27,39.1 40.64,38.46 U$6.9 U$2.9
REC
  Bottom 0.508: U$6.6 U$2.6 33.65,46.08 31.75,47.99 29.84,47.99 29.53,48.31 R9.1
REPLAY
  Bottom 0.508: U$6.5 U$2.5 33.02,48.62 R8.2
RESET  (1 unrouted)
  Bottom 0.508: 43.81,72.75 49.53,72.75 50.8,71.48 50.8,61.32 50.16,60.69 45.08,60.69 44.45,60.05 44.45,56.88 42.54,54.97 42.54,52.44 42.54,52.43 R1.1 42.54,46.08 40,43.54 U$6.7 U$2.7 | 43.81,72.75 43.18,72.12 SL1.2 | SW1.2 32.66,71.76 33.65,72.75 43.81,72.75
SPKR
  Bottom 0.508: R10.1 57.15,60.37 60.01,63.23 69.85,63.23 76.2,56.88 76.2,47.35 74.93,46.08 U$4.6 U$5.6
TEST
  Bottom 0.508: SL1.3 45.72,65.13 45.08,64.5 40.64,64.5 39.37,63.23 U$6.1 U$2.1
VCC  (via drill 0.8 pad 1.93)
  Top 0.61: v104.46,50.21 v104.46,55.29
  Bottom 0.508: IC5.8 115.16,52.42 | 104.14,49.9 104.14,49.89
  Bottom 0.61: BAT/USB.3 110.74,37.58 104.77,43.55 104.77,49.26 104.14,49.89 v104.46,50.21 | 115.16,52.42 C21.+ | C21.+ 117.46,52.44 116.84,52.44 116.84,58.79 112.39,63.23 112.39,70.22 111.39,71.22 106.31,71.22 | U$1.VBUS 120.56,49.34 C21.+ | IC5.4 110.7,47.15 109.85,47.99 109.85,49.26 109.22,49.9 104.14,49.9 | 106.31,71.22 101.87,71.22 100.96,70.31 DISCHRG.A 100.98,69.02 100.98,58.74 101.89,57.83 v104.46,55.29 | 106.31,71.22 107.58,69.95 107.58,69.41 CHRG.A
(copper drawn outside any net)
  shapes: Bottom area x4504

### Text on the board
tPlace: _ | +
tNames: IC5 | TP4056 | IC6 | MINI USB | IC3 | BL8530 | PAM8403 | PWR SRC / Li-Po / USB | IC7 | POT1 | W25QXX | IC1 | LM1117